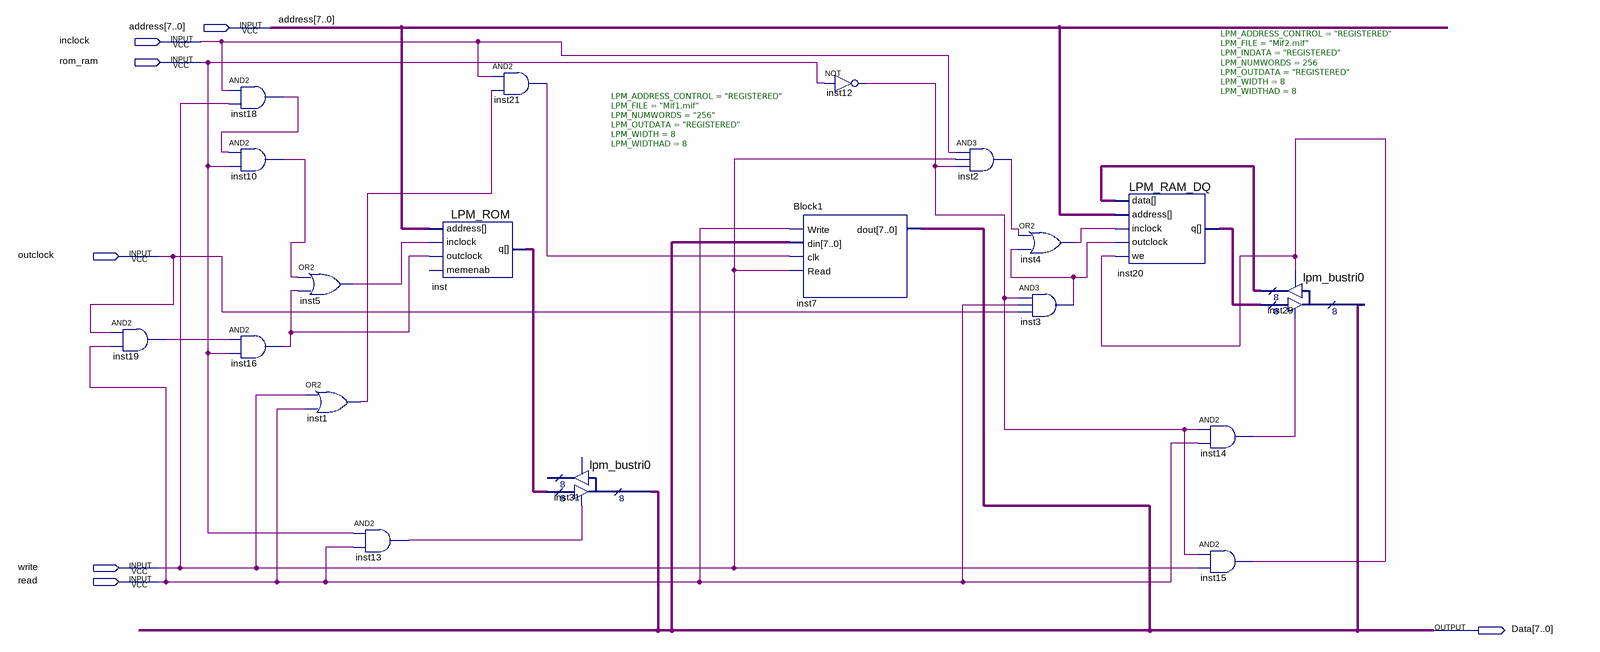
[diagram p0: schematic sheet]
// Quartus schematic sifo33.bdf as structural Verilog: 19 symbols, 7 pins
module sifo33 (
  input  [7:0] address,
  input  inclock,
  input  rom_ram,
  input  outclock,
  input  write,
  input  read,
  output [7:0] Data
);

  wire inst1_out, inst2_out, inst3_out, inst4_out, inst5_out, inst10_out, inst12_out, inst13_out, inst14_out,
       inst15_out, inst16_out, inst18_out, inst19_out, inst21_out;
  wire [7:0] inst20_q, inst29_result, inst_q;

  and inst19 (inst19_out, outclock, read);
  and inst18 (inst18_out, inclock, write);
  and inst10 (inst10_out, inst18_out, rom_ram);
  and inst16 (inst16_out, inst19_out, rom_ram);
  or inst5 (inst5_out, inst10_out, inst16_out);
  or inst1 (inst1_out, write, read);
  and inst13 (inst13_out, rom_ram, read);
  LPM_ROM #(.LPM_ADDRESS_CONTROL("REGISTERED"), .LPM_FILE("Mif1.mif"), .LPM_NUMWORDS("256"), .LPM_OUTDATA("REGISTERED"), .LPM_WIDTH(8), .LPM_WIDTHAD(8)) inst (
    .address(address), .inclock(inst5_out), .outclock(inst16_out), .q(inst_q));  // open: memenab
  and inst21 (inst21_out, inclock, inst1_out);
  lpm_bustri0 inst31 (.enabledt(inst13_out), .data(inst_q), .tridata(Data));  // open: enabletr, result
  not inst12 (inst12_out, rom_ram);
  Block1 inst7 (.Write(read), .din(Data), .clk(inst21_out), .Read(write), .dout(Data));
  and inst2 (inst2_out, inclock, write, inst12_out);
  or inst4 (inst4_out, inst2_out, inst3_out);
  and inst3 (inst3_out, inst12_out, read, outclock);
  LPM_RAM_DQ #(.LPM_ADDRESS_CONTROL("REGISTERED"), .LPM_FILE("Mif2.mif"), .LPM_INDATA("REGISTERED"), .LPM_NUMWORDS(256), .LPM_OUTDATA("REGISTERED"), .LPM_WIDTH(8), .LPM_WIDTHAD(8)) inst20 (
    .inclock(inst4_out), .data(inst29_result), .address(address), .we(inst15_out), .outclock(inst3_out),
    .q(inst20_q));
  and inst14 (inst14_out, inst12_out, read);
  and inst15 (inst15_out, inst12_out, write);
  lpm_bustri0 inst29 (
    .enabledt(inst14_out), .data(inst20_q), .enabletr(inst15_out), .result(inst29_result), .tridata(Data));
endmodule
